# Altium schematic sheet Power_Input_FET.SchDoc: Power Input
size OrCAD A; CompanyName: ZLS; DocumentNumber: LM-008; Revision: F
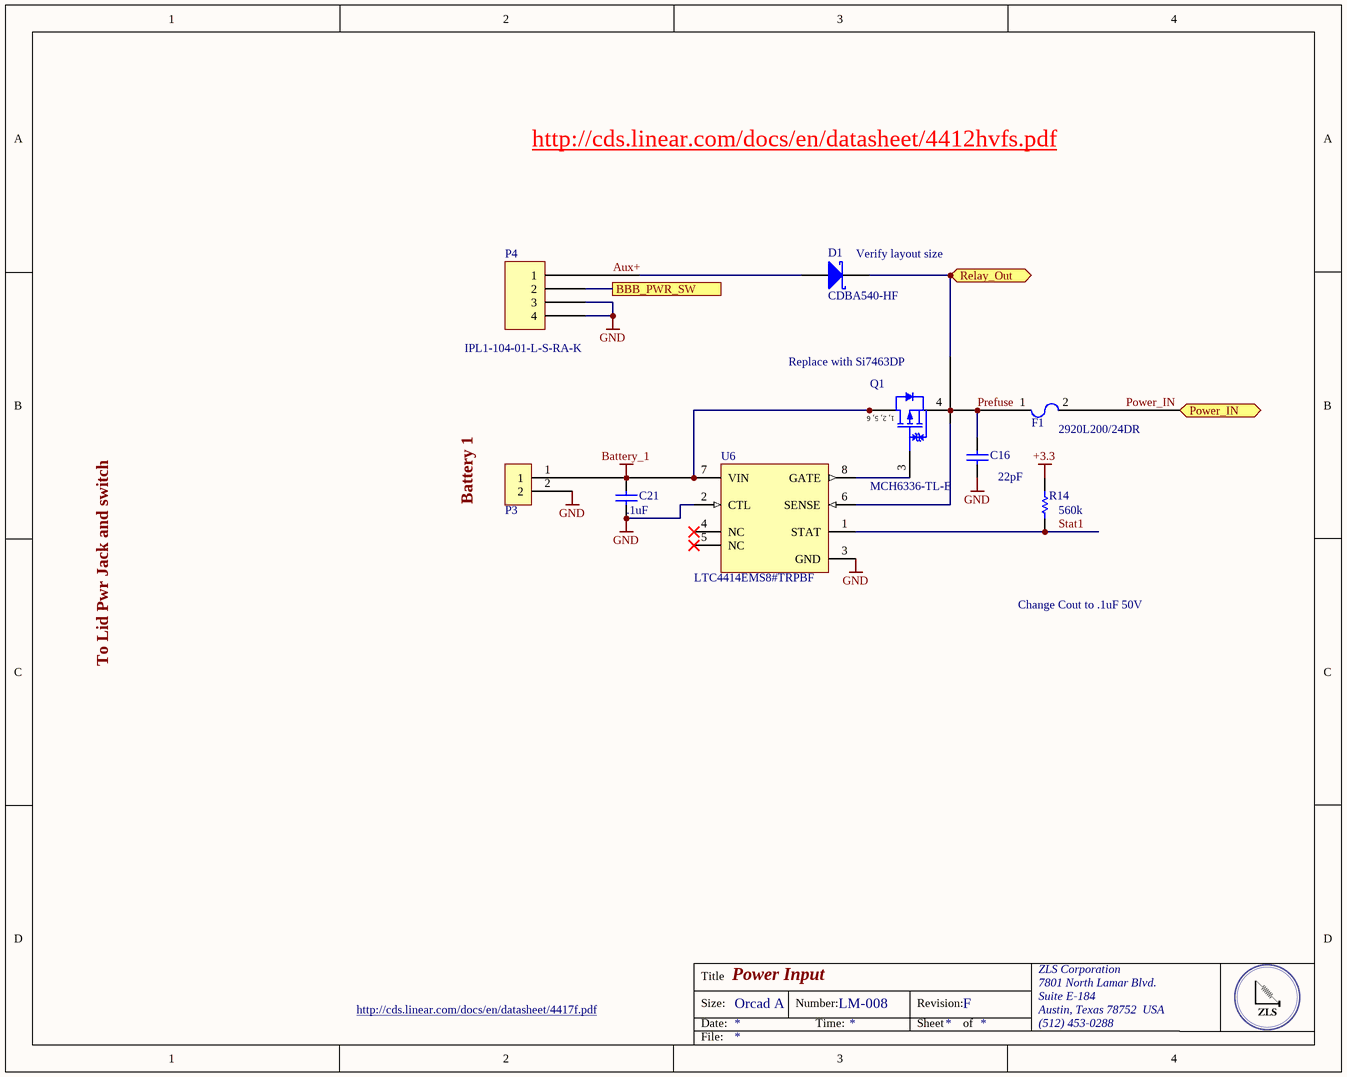
[diagram p0: Power_Input_FET.SchDoc]

## Parts
C16  Capacitance: 22pF  [CAPC1206(3216)130_N]  (hidden comment: CAP CER 10UF 6.3V X5R 1206)
C21  Capacitance: .1uF  [CAPC1206(3216)130_N]  (hidden comment: CAP CER 10UF 6.3V X5R 1206)
D1  CDBA540-HF  [VISH-DO-214AC-2_M]
F1  PCT  [CAPC7451X12N]  (value not drawn)
P3  IPL1-102-01-F-S-RA-K  [IPL1-102-01-F-S-RA-K]  (value not drawn)
P4  IPL1-104-01-L-S-RA-K  [IPL1-104-01-L-S-RA-K]
Q1  MCH6336-TL-E  [ONSC-MCPH-6_V]
R14  560k  [RESC0402(1005)_L]
U6  LTC4414EMS8#TRPBF  [LT-MS8-8_L]

## Ports
BBB_PWR_SW, Power_IN, Relay_Out

## Nets
+3.3: R14.2
Battery_1: C21.2 P3.1 Q1.1(D) Q1.2(D) Q1.5(D) Q1.6(D) U6.7(VIN)
GND: C16.1 C21.1 P3.2 P4.3 P4.4 U6.2(CTL) U6.3(GND)
Aux+: D1.1(A) P4.1
BBB_PWR_SW: P4.2 ; port BBB_PWR_SW
Power_IN: F1.2 ; port Power_IN
Prefuse: C16.2 D1.2(K) F1.1 Q1.4(S) U6.6(SENSE) ; port Relay_Out
Stat1: R14.1 U6.1(STAT)
NetQ1_3: Q1.3(G) U6.8(GATE)

Not connected (* = marked no-connect by the designer): U6 4(NC)* 5(NC)*

## Notes on the sheet
- http://cds.linear.com/docs/en/datasheet/4412hvfs.pdf
- (near D1) Verify layout size
- (near Q1) Replace with Si7463DP
- (near F1) 2920L200/24DR
- Battery 1
- Change Cout to .1uF 50V
- To Lid Pwr Jack and switch
- http://cds.linear.com/docs/en/datasheet/4417f.pdf
- Title
- Size:
- Date:
- Orcad A
- Number:
- Time:
- Revision:
- Sheet
- of
- ZLS Corporation
- 7801 North Lamar Blvd.
- Suite E-184
- Austin, Texas 78752  USA
- (512) 453-0288
- File:
- (in symbol CMP-1058-00598-1) 1, 2, 5, 6

## Library data of the parts
C16 C21 = CMP-1037-04913-1: Manufacturer: Taiyo Yuden; Manufacturer Part Number: JMK316BJ106ML-T; Tolerance: ±20%; Notification: Current market demand for these product types have resulted in fluctuating and extending lead times. Lead times may differ.; Supplier 1: Digi-Key; Supplier Part Number 1: 587-5447-1-ND; RoHS: RoHS Compliant; Category: Capacitors; Stock 1: 5600; Pricing 1: 1=0.24, 10=0.161, 100=0.0817, 500=0.05592, 1000=0.04946 (USD); Packaging: Cut Tape (CT); Part Status: Active; Voltage - Rated: 6.3V; Temperature Coefficient: X5R; Operating Temperature: -55°C ~ 85°C; Features: -; Ratings: -; Applications: SMPS Filtering; Failure Rate: -; Mounting Type: Surface Mount, MLCC; Package / Case: 1206 (3216 Metric); Size / Dimension: 0.126" L x 0.063" W (3.20mm x 1.60mm); Height - Seated (Max): -; Thickness (Max): 0.071" (1.80mm); Lead Spacing: -; Lead Style: -; ComponentLink1URL: http://ds.yuden.co.jp/TYCOMPAS/ut/detail.do?productNo=JMK316BJ106ML-T&fileName=JMK316BJ106ML-T_SS&mode=specSheetDownload; ComponentLink1Description: http://ds.yuden.co.jp/TYCOMPAS/ut/detail.do?productNo=JMK316BJ106ML-T&fileName=JMK316BJ106ML-T_SS&mode=specSheetDownload
D1 = D Schottky: DIODE SCHOTTKY 40V 5A DO214AB; Manufacturer: Comchip Technology; Speed: Fast Recovery =< 500ns, > 200mA (Io); Capacitance @ Vr, F: 380pF @ 4V, 1MHz; Supplier 1: Digi-Key; Supplier Part Number 1: 641-1707-6-ND; Manufacturer Part Number: CDBA540-HF; RoHS: RoHS Compliant; Category: Discrete Semiconductor Products; Stock 1: 7367; Pricing 1: 1=0.49, 10=0.381, 25=0.3208, 100=0.2612, 250=0.2164, 500=0.1791, 1000=0.13432, 2500=0.12313 (USD); Packaging: Digi-Reel®; Part Status: Active; Diode Type: Schottky; Current - Average Rectified (Io): 5A; Mounting Type: Surface Mount; Package / Case: DO-214AC, SMA; Supplier Device Package: DO-214AC (SMA); Operating Temperature - Junction: -50°C ~ 150°C; ComponentLink1URL: http://www.comchiptech.com/cms/UserFiles/CDBA540-HF%20Thru505315.%20CDBA5200-HF%20RevC.pdf; ComponentLink1Description: http://www.comchiptech.com/cms/UserFiles/CDBA540-HF%20Thru505315.%20CDBA5200-HF%20RevC.pdf
P4 = IPL1-104-01-L-S-RA-K: Manufacturer: Samtec Inc.; Connector Type: Header; Pitch - Mating: 0.100" (2.54mm); Number of Positions: 4; Number of Positions Loaded: All; Style: Board to Cable/Wire; Shrouding: Shrouded - 4 Wall; Contact Length - Mating: 0.215" (5.46mm); Contact Length - Post: 0.085" (2.16mm); Material Flammability Rating: UL94 V-0; Voltage Rating: 675VAC, 954VDC; Supplier 1: Digi-Key; Supplier Part Number 1: SAM9597-ND; Manufacturer Part Number: IPL1-104-01-L-S-RA-K; RoHS: RoHS Compliant; Category: Connectors, Interconnects; Stock 1: 265; Pricing 1: 1=2.53, 10=2.424, 100=2.02, 500=1.717, 1000=1.4645, 5000=1.313 (USD); Packaging: Tube; Part Status: Active; Contact Type: Male Pin; Number of Rows: 1; Row Spacing - Mating: -; Mounting Type: Through Hole, Right Angle; Termination: Solder; Fastening Type: Locking Ramp; Overall Contact Length: -; Insulation Height: 0.240" (6.10mm); Contact Shape: Square; Contact Finish - Mating: Gold; Contact Finish Thickness - Mating: 10µin (0.25µm); Contact Finish - Post: Tin; Contact Material: Phosphor Bronze; Insulation Material: Liquid Crystal Polymer (LCP); Features: -; Operating Temperature: -55°C ~ 125°C; Ingress Protection: -; Insulation Color: Natural; Current Rating: -; Mated Stacking Heights: -; Contact Finish Thickness - Post: -; Applications: -; ComponentLink1URL: http://suddendocs.samtec.com/prints/ipl1-1xx-xx-xxx-s-xx-x-xx-mkt.pdf; ComponentLink1Description: http://suddendocs.samtec.com/prints/ipl1-1xx-xx-xxx-s-xx-x-xx-mkt.pdf
Q1 = CMP-1058-00598-1: P-Channel Power MOSFET, -12 V, -5 A, 43 mOhm, Single, 6-Pin MCPH, Pb-Free, Tape and Reel; Manufacturer: On Semiconductor; Channel Polarity: P Channel; VGS(th) Max (V): 1.4; Ciss Typ (pF): 660; V(BR)DSS Min (V): 12; VGS Max (V): 10; Crss Typ (pF): 155; Coss Typ (pF): 210; PD Max (W): 1.5; ID Max (A): 5; Package Type: SC-88FL / MCPH-6; ComponentLink2URL: http://www.onsemi.cn/pub_link/Collateral/MCH6336-D.PDF; ComponentLink3URL: http://www.onsemi.com/pub_link/Collateral/ENA1601-D.PDF; RoHS: Pb-Free; Mounting Technology: Surface Mount; PartNumber: MCH6336-TL-E; ComponentLink2Description: Datasheet; ComponentLink1URL: http://www.onsemi.com/; ComponentLink1Description: Manufacturer URL; Configuration: Single; ComponentLink3Description: Package Specification; Packing: Tape and Reel; PackageDescription: 6-Pin Small Outline Transistor, Body 2 x 1.6 mm, Pitch 0.65 mm; PackageReference: MCPH-6
R14 = CMP-1011-00927-1: Tolerance: ±1%; Temperature Coefficient: ±100ppm/°C; Supplier Part Number 1: YAG3220CT-ND; Supplier Device Package: 0402
U6 = CMP-0479-00214-1: Low Loss PowerPath Controller for Large PFET, 3 to 36 V Vin, 8-pin SOP (MS8-8), -40 to 85 degC, Pb-Free, Tape and Reel; Manufacturer: Linear Technology; Ideal Diode: Single, External, P-Channel; ComponentLink3URL: http://cds.linear.com/docs/en/packaging/05081660_G_MS8.pdf; DatasheetVersion: Rev. C; ComponentLink2Description: Datasheet; ComponentLink1Description: Manufacturer URL; ComponentLink2URL: http://cds.linear.com/docs/en/datasheet/4414fc.pdf; ComponentLink3Description: Package Specification; ComponentLink1URL: http://www.linear.com/; Packing: Tape and Reel; Mounting Technology: Surface Mount; PackageDescription: 8-Pin Plastic MSOP, Body 3 x 3 mm, Pitch 0.65 mm; PackageVersion: Rev. G, 03/2012; PackageReference: MS8-8; PartNumber: LTC4414EMS8#TRPBF; RoHS: TRUE